# Altium schematic sheet 05_CONNECTOR_OUT.SchDoc
size 420 x 297 mm; SheetNumber: 6; SheetTotal: 36
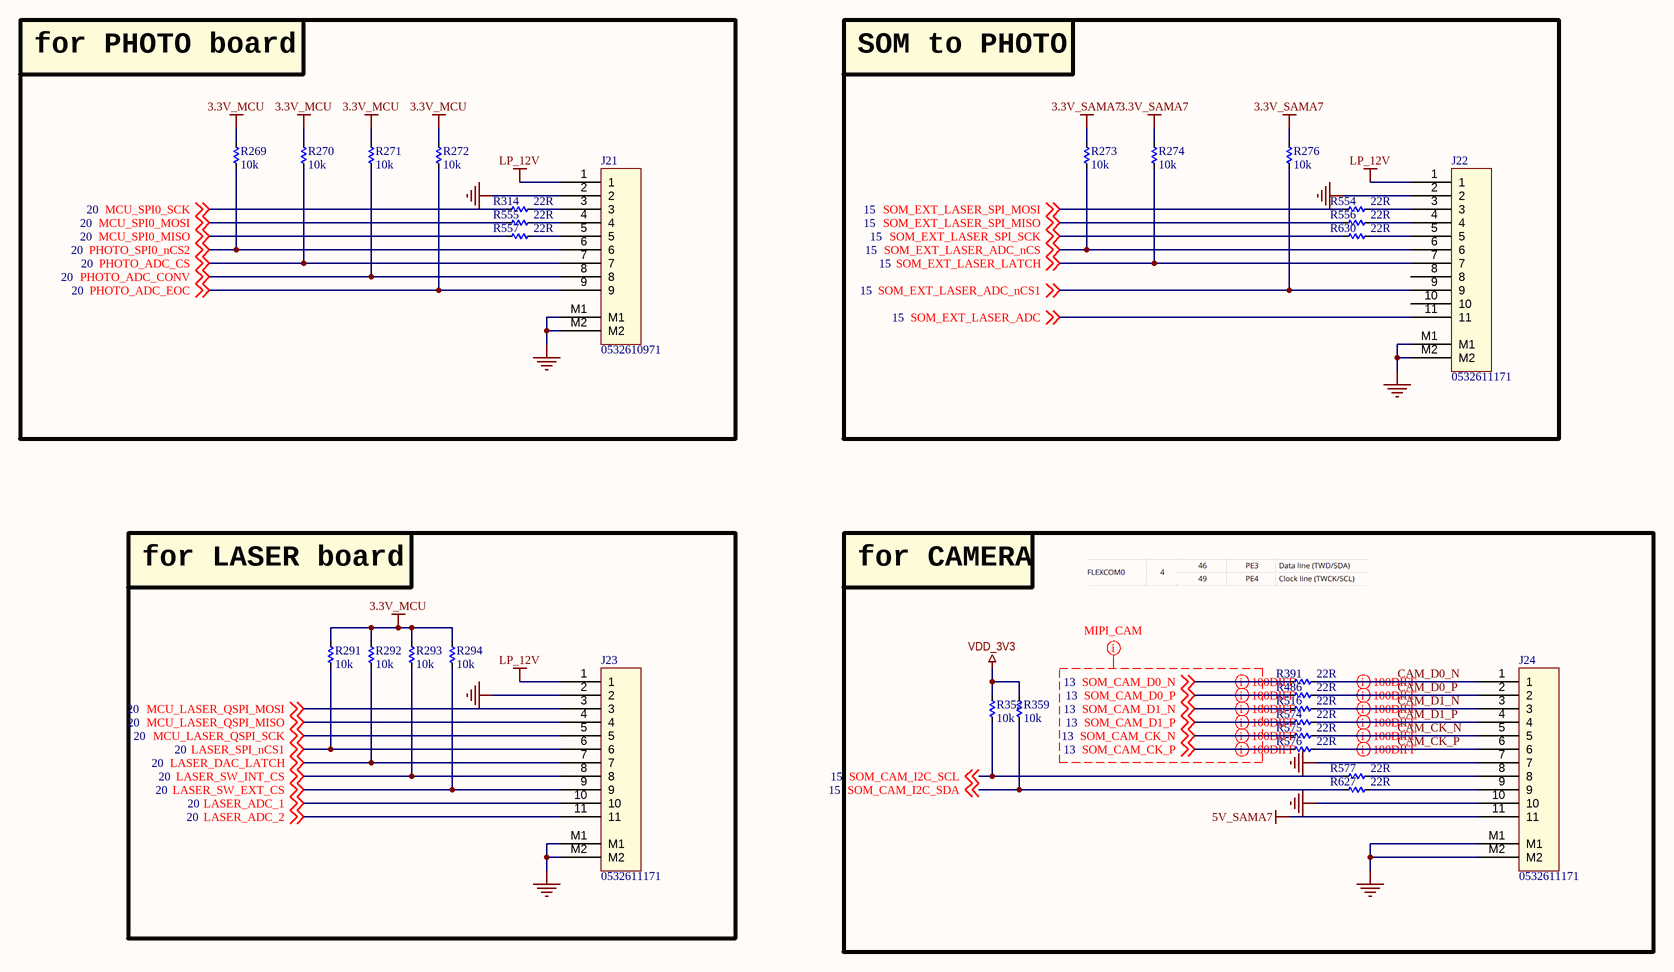
[diagram p0: 05_CONNECTOR_OUT.SchDoc]

## Parts
J21  0532610971  [MOLEX_0532610971]
J22  0532611171  [MOLEX_0532611171]
J23  0532611171  [MOLEX_0532611171]
J24  0532611171  [MOLEX_0532611171]
R269  10k  [RES_C_1005X40]
R270  10k  [RES_C_1005X40]
R271  10k  [RES_C_1005X40]
R272  10k  [RES_C_1005X40]
R273  10k  [RES_C_1005X40]
R274  10k  [RES_C_1005X40]
R276  10k  [RES_C_1005X40]
R291  10k  [RES_C_1005X40]
R292  10k  [RES_C_1005X40]
R293  10k  [RES_C_1005X40]
R294  10k  [RES_C_1005X40]
R314  22R  [RES_C_1005X40]
R352  10k  [RES_C_1005X40]
R359  10k  [RES_C_1005X40]
R391  22R  [RES_C_1005X40]
R486  22R  [RES_C_1005X40]
R516  22R  [RES_C_1005X40]
R554  22R  [RES_C_1005X40]
R555  22R  [RES_C_1005X40]
R556  22R  [RES_C_1005X40]
R557  22R  [RES_C_1005X40]
R574  22R  [RES_C_1005X40]
R575  22R  [RES_C_1005X40]
R576  22R  [RES_C_1005X40]
R577  22R  [RES_C_1005X40]
R627  22R  [RES_C_1005X40]
R630  22R  [RES_C_1005X40]

## Blocks framed on the sheet
for PHOTO board: J21 R269-R272 R314 R555 R557
SOM to PHOTO: J22 R273 R274 R276 R554 R556 R630
for LASER board: J23 R291-R294
for CAMERA: J24 R352 R359 R391 R486 R516 R574-R577 R627

## Nets
3.3V_MCU: R269.1 R270.1 R271.1 R272.1 R291.1 R292.1 R293.1 R294.1
3.3V_SAMA7: R273.1 R274.1 R276.1
5V_SAMA7: J24.11
GND: J21.2 J21.M1 J21.M2 J22.2 J22.M1 J22.M2 J23.2 J23.M1 J23.M2 J24.7 J24.10 J24.M1 J24.M2
LP_12V: J21.1 J22.1 J23.1
VDD_3V3: R352.1 R359.1
CAM_CK_N: J24.5 R575.2
CAM_CK_P: J24.6 R576.2
CAM_D0_N: J24.1 R391.2
CAM_D0_P: J24.2 R486.2
CAM_D1_N: J24.3 R516.2
CAM_D1_P: J24.4 R574.2
LASER_ADC_1: J23.10 ; off-sheet LASER_ADC_1
LASER_ADC_2: J23.11 ; off-sheet LASER_ADC_2
LASER_DAC_LATCH: J23.7 R292.2 ; off-sheet LASER_DAC_LATCH
LASER_SPI_nCS1: J23.6 R291.2 ; off-sheet LASER_SPI_nCS1
LASER_SW_EXT_CS: J23.9 R294.2 ; off-sheet LASER_SW_EXT_CS
LASER_SW_INT_CS: J23.8 R293.2 ; off-sheet LASER_SW_INT_CS
MCU_LASER_QSPI_MISO: J23.4 ; off-sheet MCU_LASER_QSPI_MISO
MCU_LASER_QSPI_MOSI: J23.3 ; off-sheet MCU_LASER_QSPI_MOSI
MCU_LASER_QSPI_SCK: J23.5 ; off-sheet MCU_LASER_QSPI_SCK
MCU_SPI0_MISO: R557.1 ; off-sheet MCU_SPI0_MISO
MCU_SPI0_MOSI: R555.1 ; off-sheet MCU_SPI0_MOSI
MCU_SPI0_SCK: R314.1 ; off-sheet MCU_SPI0_SCK
PHOTO_ADC_CONV: J21.8 R271.2 ; off-sheet PHOTO_ADC_CONV
PHOTO_ADC_CS: J21.7 R270.2 ; off-sheet PHOTO_ADC_CS
PHOTO_ADC_EOC: J21.9 R272.2 ; off-sheet PHOTO_ADC_EOC
PHOTO_SPI0_nCS2: J21.6 R269.2 ; off-sheet PHOTO_SPI0_nCS2
SOM_CAM_CK_N: R575.1 ; off-sheet SOM_CAM_CK_N
SOM_CAM_CK_P: R576.1 ; off-sheet SOM_CAM_CK_P
SOM_CAM_D0_N: R391.1 ; off-sheet SOM_CAM_D0_N
SOM_CAM_D0_P: R486.1 ; off-sheet SOM_CAM_D0_P
SOM_CAM_D1_N: R516.1 ; off-sheet SOM_CAM_D1_N
SOM_CAM_D1_P: R574.1 ; off-sheet SOM_CAM_D1_P
SOM_CAM_I2C_SCL: R352.2 R577.1 ; off-sheet SOM_CAM_I2C_SCL
SOM_CAM_I2C_SDA: R359.2 R627.1 ; off-sheet SOM_CAM_I2C_SDA
SOM_EXT_LASER_ADC: J22.11 ; off-sheet SOM_EXT_LASER_ADC
SOM_EXT_LASER_ADC_nCS: J22.6 R273.2 ; off-sheet SOM_EXT_LASER_ADC_nCS
SOM_EXT_LASER_ADC_nCS1: J22.9 R276.2 ; off-sheet SOM_EXT_LASER_ADC_nCS1
SOM_EXT_LASER_LATCH: J22.7 R274.2 ; off-sheet SOM_EXT_LASER_LATCH
SOM_EXT_LASER_SPI_MISO: R556.1 ; off-sheet SOM_EXT_LASER_SPI_MISO
SOM_EXT_LASER_SPI_MOSI: R554.1 ; off-sheet SOM_EXT_LASER_SPI_MOSI
SOM_EXT_LASER_SPI_SCK: R630.1 ; off-sheet SOM_EXT_LASER_SPI_SCK
NetJ21_3: J21.3 R314.2
NetJ21_4: J21.4 R555.2
NetJ21_5: J21.5 R557.2
NetJ22_3: J22.3 R554.2
NetJ22_4: J22.4 R556.2
NetJ22_5: J22.5 R630.2
NetJ24_8: J24.8 R577.2
NetJ24_9: J24.9 R627.2

Not connected (* = marked no-connect by the designer): J22 8 10

## Layout directives
differential pair; differential pair class DIFF100: CAM_CK_N, CAM_CK_P, CAM_D0_N, CAM_D0_P, CAM_D1_N, CAM_D1_P, SOM_CAM_CK_N, SOM_CAM_CK_P, SOM_CAM_D0_N, SOM_CAM_D0_P, SOM_CAM_D1_N, SOM_CAM_D1_P
net class MIPI_CAM: SOM_CAM_CK_N, SOM_CAM_CK_P, SOM_CAM_D0_N, SOM_CAM_D0_P, SOM_CAM_D1_N, SOM_CAM_D1_P

## Notes on the sheet
- Project:
- Sub-system:
- Design by:
- Sheet title:
- Sheet
- of
- Checked by:
- Approved by:
- Revision:
- Document No:
- Size:
- Date:
- A3

## Library data of the parts
J21 = Header 9x1_2M
J22-J24 = Header 11x1_2M
R269-R274 R276 R291-R294 R314 R352 R359 R391 R486 R516 R554-R557 R574-R577 R627 R630 = _RES_B_2: RES